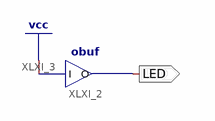
[diagram p0: schematic sheet 1]
// Xilinx ISE schematic CPLDintro1LEDon.sch (xc9500xl) as structural Verilog: 1 symbols, 1 ports
module CPLDintro1LEDon (
  output LED
);

  obuf XLXI_2 (.I(1'b1), .O(LED));
endmodule
